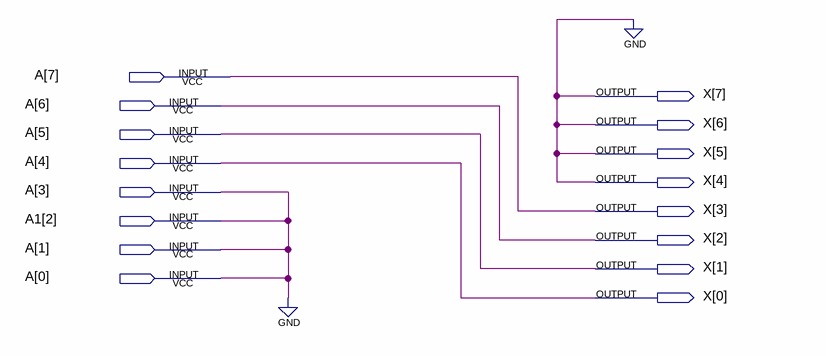
[diagram p0: schematic sheet]
// Quartus schematic CORR4.bdf as structural Verilog: 0 symbols, 16 pins
module CORR4 (
  input  [7:0] A,
  input  [2:2] A1,
  output [7:0] X
);


  assign A[1:0] = {2{A[3]}};
  assign A1[2] = A[3];
  assign X = {4'b0000, A[7:4]};
  // also tied to GND on the sheet: A[3]
endmodule
